# Altium project BUTTON.PrjPCB
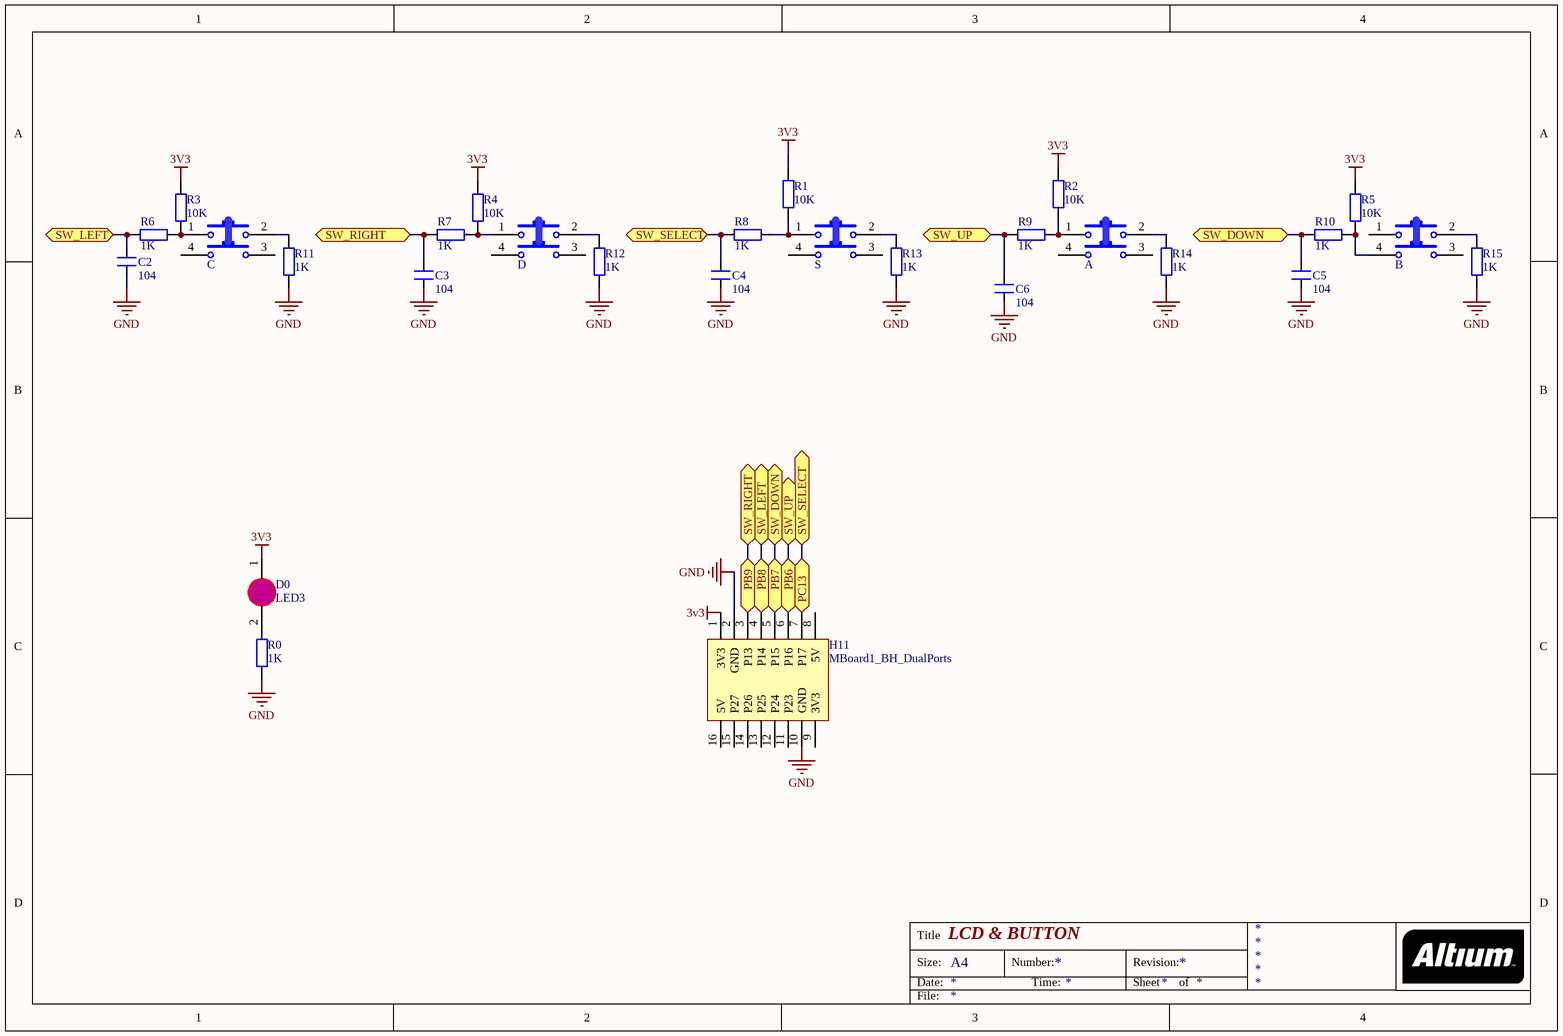
[diagram p0: Button.SchDoc]
1 sheet, 28 parts. Net scope: flat (ports and power ports of the same name join across sheets).
Board file: PCB_Button.PcbDoc

## Sheet Button.SchDoc: LCD & BUTTON
size A4; Date: 10/04/2015; Author: MINH; DrawnBy: Minh

### Parts
A  SW-4P-S  [SW4]  (value not drawn)
B  SW-4P-S  [SW4]  (value not drawn)
C  SW-4P-S  [SW4]  (value not drawn)
C2  104  [SM-0805]
C3  104  [SM-0805]
C4  104  [SM-0805]
C5  104  [SM-0805]
C6  104  [SM-0805]
D  SW-4P-S  [SW4]  (value not drawn)
D0  LED3  [SMD0805LED]
H11  MBoard1_BH_DualPorts  [MBoard1_BH_DualPorts]
R0  value 1K  [SMD0805R]  (hidden comment: R)
R1  value 10K  [SMD0805R]  (hidden comment: R)
R2  value 10K  [SMD0805R]  (hidden comment: R)
R3  value 10K  [SMD0805R]  (hidden comment: R)
R4  value 10K  [SMD0805R]  (hidden comment: R)
R5  value 10K  [SMD0805R]  (hidden comment: R)
R6  value 1K  [SMD0805R]  (hidden comment: R)
R7  value 1K  [SMD0805R]  (hidden comment: R)
R8  value 1K  [SMD0805R]  (hidden comment: R)
R9  value 1K  [SMD0805R]  (hidden comment: R)
R10  value 1K  [SMD0805R]  (hidden comment: R)
R11  value 1K  [SMD0805R]  (hidden comment: R)
R12  value 1K  [SMD0805R]  (hidden comment: R)
R13  value 1K  [SMD0805R]  (hidden comment: R)
R14  value 1K  [SMD0805R]  (hidden comment: R)
R15  value 1K  [SMD0805R]  (hidden comment: R)
S  SW-4P-S  [SW4]  (value not drawn)

### Ports
PB6, PB7, PB8, PB9, PC13, SW_DOWN, SW_LEFT, SW_RIGHT, SW_SELECT, SW_UP

### Nets
3V3: D0.1(A) H11.1(3V3) R1.2 R2.1 R3.2 R4.2 R5.2
GND: C2.1 C3.1 C4.1 C5.1 C6.2 H11.2(GND) H11.10(GND) R0.2 R11.2 R12.2 R13.2 R14.2 R15.2
NetA_1: A.1 R2.2 R9.1
NetA_2: A.2 R14.1
NetB_2: B.2 R15.1
NetB_4: B.4 R5.1 R10.1
NetC2_2: C2.2 H11.4(P14) R6.2 ; port SW_LEFT, port PB8
NetC3_2: C3.2 H11.3(P13) R7.2 ; port SW_RIGHT, port PB9
NetC4_2: C4.2 H11.7(P17) R8.2 ; port SW_SELECT, port PC13
NetC5_2: C5.2 H11.5(P15) R10.2 ; port SW_DOWN, port PB7
NetC6_1: C6.1 H11.6(P16) R9.2 ; port SW_UP, port PB6
NetC_1: C.1 R3.1 R6.1
NetC_2: C.2 R11.1
NetD0_2: D0.2(K) R0.1
NetD_1: D.1 R4.1 R7.1
NetD_2: D.2 R12.1
NetR1_1: R1.1 R8.1 S.1
NetR13_1: R13.1 S.2

Not connected (* = marked no-connect by the designer): A 3 4; B 1 3; C 3 4; D 3 4; H11 8(5V) 9(3V3) 11(P23) 12(P24) 13(P25) 14(P26) 15(P27) 16(5V); S 3 4

### Notes on the sheet
- Title
- Size:
- Date:
- A4
- Number:
- Time:
- Revision:
- Sheet
- of
- File:

### Library data of the parts
A B C D S = SW-4PIN-SMALL: Switch Small 4 Pin; Published: 24-Mar-1999; LatestRevisionDate: 17-Jul-2002; LatestRevisionNote: Re-released for DXP Platform.; PackageReference: SPST-2; Publisher: Altium Limited
C2 C3 C5 C6 = CM: Cap SMD; Value: 103
C4 = CM: Cap SMD; Value: 104
D0 = LEDSMD: LED SMD
R0-R15 = R: RES_08; Published: 8-Jun-2000; LatestRevisionDate: 17-Jul-2002; LatestRevisionNote: Re-released for DXP Platform.; PackageReference: AXIAL-0.4; Publisher: Altium Limited